# Altium schematic sheet RegisterA.SchDoc: A Register
size A4; Author: Ben Eater; DrawnBy: LittleYe233; DocumentNumber: 2; SheetNumber: 2; SheetTotal: 7
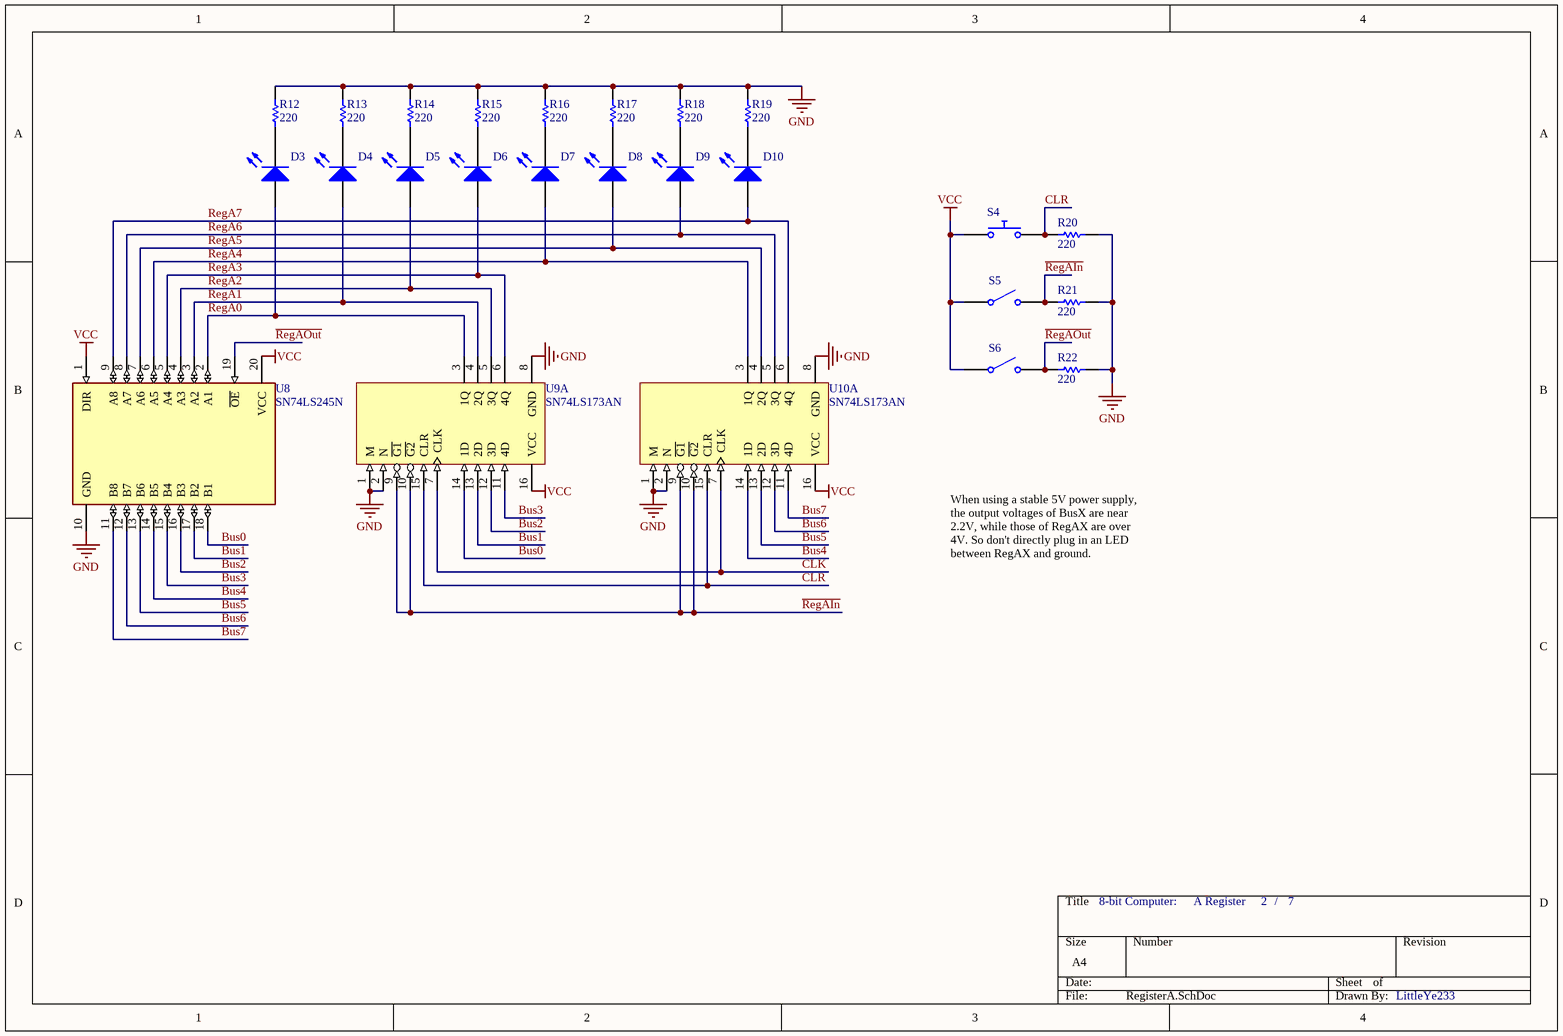
[diagram p0: RegisterA.SchDoc]

## Parts
D3  Light-Emitting Diode  (value not drawn)
D4  Light-Emitting Diode  (value not drawn)
D5  Light-Emitting Diode  (value not drawn)
D6  Light-Emitting Diode  (value not drawn)
D7  Light-Emitting Diode  (value not drawn)
D8  Light-Emitting Diode  (value not drawn)
D9  Light-Emitting Diode  (value not drawn)
D10  Light-Emitting Diode  (value not drawn)
R12  value 220  (hidden comment: Resistor)
R13  value 220  (hidden comment: Resistor)
R14  value 220  (hidden comment: Resistor)
R15  value 220  (hidden comment: Resistor)
R16  value 220  (hidden comment: Resistor)
R17  value 220  (hidden comment: Resistor)
R18  value 220  (hidden comment: Resistor)
R19  value 220  (hidden comment: Resistor)
R20  value 220  (hidden comment: Resistor)
R21  value 220  (hidden comment: Resistor)
R22  value 220  (hidden comment: Resistor)
S4  Push Button Normally Opened  (value not drawn)
S5  Single-Pole, Single-Throw Switch  (value not drawn)
S6  Single-Pole, Single-Throw Switch  (value not drawn)
U8  SN74LS245N  [FP-N0020A-MFG]
U9  SN74LS173AN  [N0016A]  (part A of 2)
U10  SN74LS173AN  [N0016A]  (part A of 2)

## Nets
GND: R12.2 R13.2 R14.2 R15.2 R16.2 R17.2 R18.2 R19.2 R20.1 R21.1 R22.1 U8.10(GND) U9.1(M) U9.2(N) U9.8(GND) U10.1(M) U10.2(N) U10.8(GND)
VCC: S4.1 S5.1 S6.1 U8.1(DIR) U8.20(VCC) U9.16(VCC) U10.16(VCC)
Bus0: U8.18(B1) U9.14(1D)
Bus1: U8.17(B2) U9.13(2D)
Bus2: U8.16(B3) U9.12(3D)
Bus3: U8.15(B4) U9.11(4D)
Bus4: U8.14(B5) U10.14(1D)
Bus5: U8.13(B6) U10.13(2D)
Bus6: U8.12(B7) U10.12(3D)
Bus7: U8.11(B8) U10.11(4D)
CLK: U9.7(CLK) U10.7(CLK)
CLR: R20.2 S4.2 U9.15(CLR) U10.15(CLR)
~{RegAIn}: R21.2 S5.2 U9.9(~{G1}) U9.10(~{G2}) U10.9(~{G1}) U10.10(~{G2})
~{RegAOut}: R22.2 S6.2 U8.19(~{OE})
RegA0: D3.1(A) U8.2(A1) U9.3(1Q)
RegA1: D4.1(A) U8.3(A2) U9.4(2Q)
RegA2: D5.1(A) U8.4(A3) U9.5(3Q)
RegA3: D6.1(A) U8.5(A4) U9.6(4Q)
RegA4: D7.1(A) U8.6(A5) U10.3(1Q)
RegA5: D8.1(A) U8.7(A6) U10.4(2Q)
RegA6: D9.1(A) U8.8(A7) U10.5(3Q)
RegA7: D10.1(A) U8.9(A8) U10.6(4Q)
NetD3_2: D3.2(K) R12.1
NetD4_2: D4.2(K) R13.1
NetD5_2: D5.2(K) R14.1
NetD6_2: D6.2(K) R15.1
NetD7_2: D7.2(K) R16.1
NetD8_2: D8.2(K) R17.1
NetD9_2: D9.2(K) R18.1
NetD10_2: D10.2(K) R19.1

## Notes on the sheet
- When using a stable 5V power supply, the output voltages of BusX are near 2.2V, while those of RegAX are over 4V. So don't directly plug in an LED between RegAX and ground.
- 8-bit Computer:
- /

## Library data of the parts
D3-D10 = LED: AF: 1; BV: 0; BV_MAX: 1e99; EG: 1.11; FC: 0.5; IBV: 0.001; IS: 1e-14; MJSW: 0.33; NTUN: 30; TNOM: 27; XTI: 3; SimulationGenericComponent: True; CJO: 0; CJP: 0; CTA: 0; CTP: 0; FCS: 0.5; FV_MAX: 1e99; IKF: 0; IKR: 0; ISR: 1e-14; JSW: 0; JTUN: 0; JTUNSW: 0; KEG: 1; KF: 0; LEVEL: 1; N: 1; NBV: 1; NR: 1; NS: 1; PHP: 1; RS: 0; TCV: 0; TLEV: 0; TLEVC: 0; TM1: 0; TM2: 0; TPB: 0; TPHP: 0; TRS: 0; TRS2: 0; TT: 0; TTT1: 0; TTT2: 0; VJ: 1; XTITUN: 3
R12-R22 = Resistor: TC1: 0; SimulationGenericComponent: True; TC2: 0
S4 = Push Button NO: closed: 0; Rclosed: 1m; Ropen: 1Meg; SimulationGenericComponent: True
S5 S6 = SPST SW: closed: 0; Rclosed: 1m; Ropen: 1Meg; SimulationGenericComponent: True
U8 = CMP-1620-00419-3: IC TXRX NON-INVERT 5.25V 20DIP; Number of Bits per Element: 8; Polarity: Non-Inverting; Low Level Output Current: 24mA; Propagation Delay: 12ns; Min Supply Voltage: 4.75V; Number of Elements: 1; Quiescent Current: 62mA; Logic Function: Transceiver; Direction: Bidirectional; Operating Supply Voltage: 5V; High Level Output Current: -15mA; Mount: Through Hole; Min Operating Temperature: 0°C; Number of Outputs: 8; Max Operating Temperature: 70°C; Max Supply Voltage: 5.25V; Width: 6.35mm; Number of Pins: 20; RoHS Compliant: Yes; Turn-On Delay Time: 12ns; Termination: Through Hole; Number of Channels: 8; Number of Circuits: 8; Weight: 0.042297oz; Package Quantity: 20; Number of Transceivers: 8; Length: 24.33mm; Height: 4.57mm; REACH SVHC: No SVHC; Contact Plating: Gold; Number of Bits: 8; Lead Free: Lead Free; Case/Package: PDIP; Packaging: Rail/Tube; Radiation Hardening: No
U9 U10 = CMP-1619-00777-2: 4-Bit D-type Registers with 3-State Outputs, N0016A, TUBE; Manufacturer: Texas Instruments; VCC(Max)(V): 5.25; ICC @ Nom Voltage(Max)(mA): 24; F @ Nom Voltage(Max)(Mhz): 35; Bits(#): 4; tpd @ Nom Voltage(Max)(ns): 30; Output Logic: Non-inverted; VCC(Min)(V): 4.75; 3-State Output: Yes; Voltage(Nom)(V): 5; Output Drive (IOL/IOH)(Max)(mA): 24/-2.6; Rating: Catalog; Output: 3S; Input Type: TTL; Technology Family: LS; Schmitt Trigger: No; Operating Temperature Range(C): 0 to 70; DatasheetVersion: SDLS067A; Generic Part Number: SN74LS173A; Output Type: TTL; PackageReference: N0016A; Code_JEDEC: MS-001